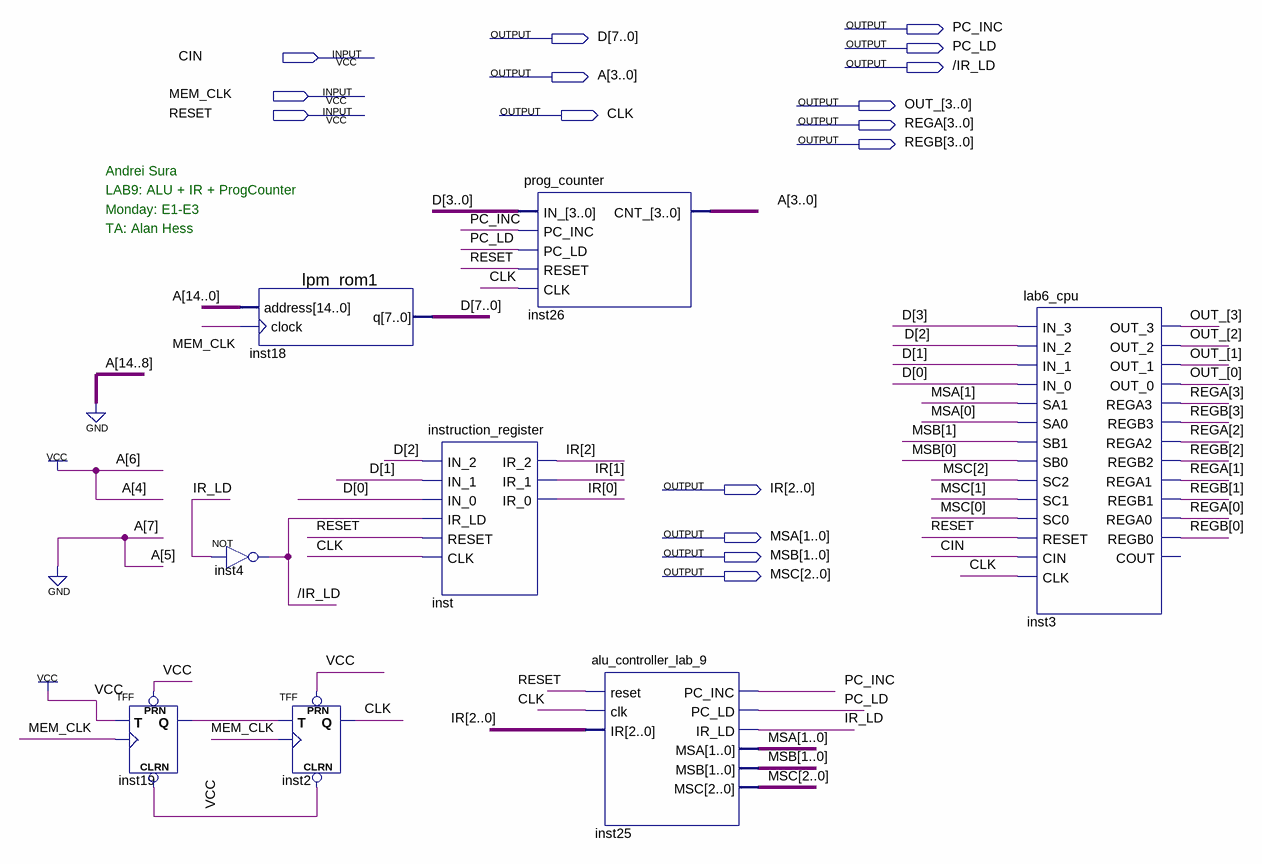
[diagram p0: schematic sheet]
// Quartus schematic alu_ir_pc.bdf as structural Verilog: 8 symbols, 16 pins
module alu_ir_pc (
  input  CIN,
  input  MEM_CLK,
  input  RESET,
  output PC_INC,
  output [7:0] D,
  output PC_LD,
  output \/IR_LD ,
  output [3:0] A,
  output [3:0] OUT_,
  output CLK,
  output [3:0] REGA,
  output [3:0] REGB,
  output [2:0] IR,
  output [1:0] MSA,
  output [1:0] MSB,
  output [2:0] MSC
);

  wire inst19_q, IR_LD;

  TFF inst19 (.PRN(1'b1), .CLRN(1'b1), .T(1'b1), .CLK(MEM_CLK), .Q(inst19_q));
  not inst4 (\/IR_LD , IR_LD);
  lpm_rom1 inst18 (.address({11'b00000000101, A}), .clock(MEM_CLK), .q(D));
  TFF inst2 (.PRN(1'b1), .CLRN(1'b1), .T(inst19_q), .CLK(MEM_CLK), .Q(CLK));
  instruction_register inst (
    .IN_2(D[2]), .IN_1(D[1]), .IN_0(D[0]), .IR_LD(\/IR_LD ), .RESET(RESET), .CLK(CLK), .IR_2(IR[2]),
    .IR_1(IR[1]), .IR_0(IR[0]));
  prog_counter inst26 (.IN_(D[3:0]), .PC_INC(PC_INC), .PC_LD(PC_LD), .RESET(RESET), .CLK(CLK), .CNT_(A));
  alu_controller_lab_9 inst25 (
    .reset(RESET), .clk(CLK), .IR(IR), .PC_INC(PC_INC), .PC_LD(PC_LD), .IR_LD(IR_LD), .MSA(MSA), .MSB(MSB),
    .MSC(MSC));
  lab6_cpu inst3 (
    .IN_3(D[3]), .IN_2(D[2]), .IN_1(D[1]), .IN_0(D[0]), .SA1(MSA[1]), .SA0(MSA[0]), .SB1(MSB[1]),
    .SB0(MSB[0]), .SC2(MSC[2]), .SC1(MSC[1]), .SC0(MSC[0]), .RESET(RESET), .CIN(CIN), .CLK(CLK),
    .OUT_3(OUT_[3]), .OUT_2(OUT_[2]), .OUT_1(OUT_[1]), .OUT_0(OUT_[0]), .REGA3(REGA[3]), .REGB3(REGB[3]),
    .REGA2(REGA[2]), .REGB2(REGB[2]), .REGA1(REGA[1]), .REGB1(REGB[1]), .REGA0(REGA[0]), .REGB0(REGB[0]));  // open: COUT

  // Notes on the sheet:
  //   Andrei Sura
  //   LAB9: ALU + IR + ProgCounter
  //   Monday: E1-E3
  //   TA: Alan Hess
endmodule
